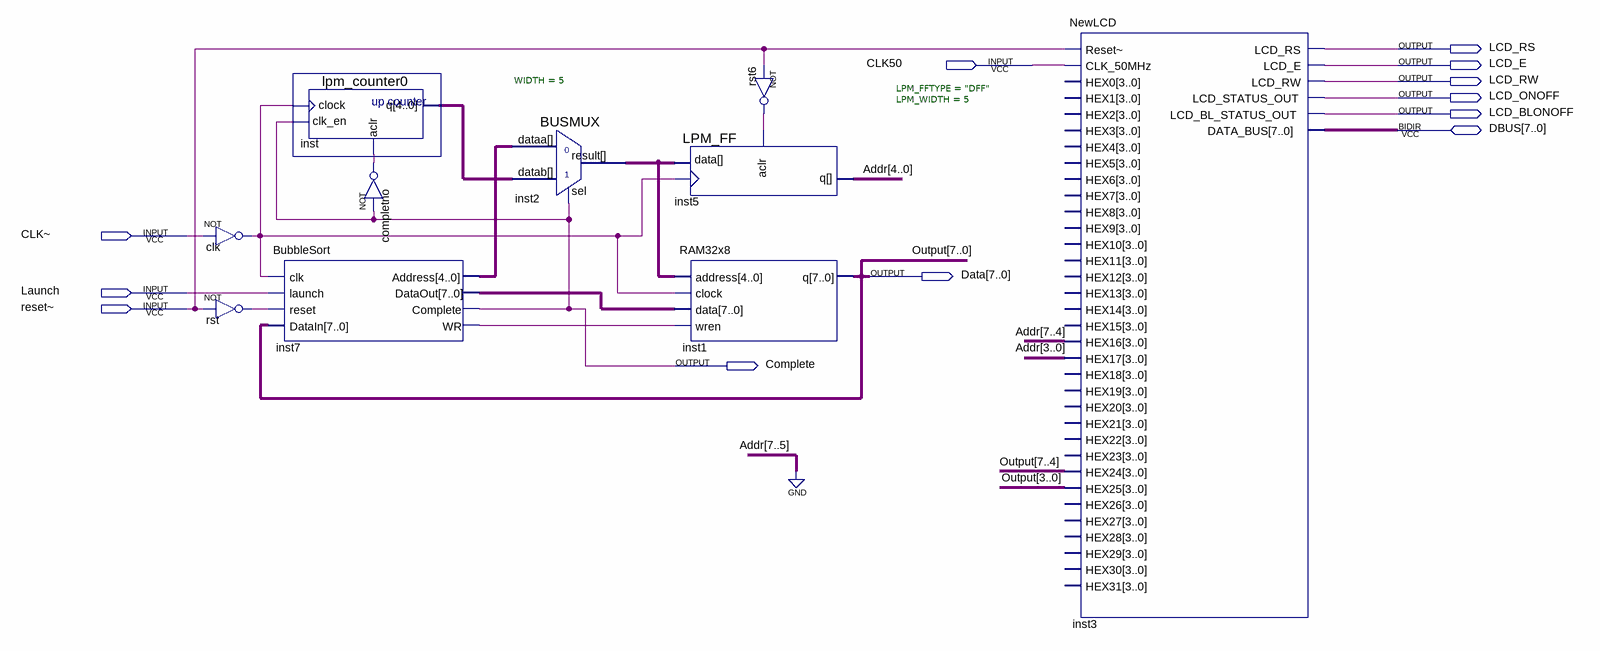
[diagram p0: schematic sheet]
// Quartus schematic Sorterbdf.bdf as structural Verilog: 10 symbols, 12 pins
module Sorterbdf (
  input  CLK50,
  input  \CLK~ ,
  input  Launch,
  input  \reset~ ,
  inout  [7:0] DBUS,
  output LCD_RS,
  output LCD_E,
  output LCD_RW,
  output LCD_ONOFF,
  output LCD_BLONOFF,
  output [7:0] Data,
  output Complete
);

  wire clk_out, completno_out, inst7_wr, rst6_out, rst_out;
  wire [4:0] Addr, inst2_result, inst7_address, inst_q;
  wire [7:0] inst7_dataout;

  not clk (clk_out, \CLK~ );
  not rst (rst_out, \reset~ );
  BubbleSort inst7 (
    .clk(clk_out), .launch(Launch), .reset(rst_out), .DataIn(Data), .Address(inst7_address),
    .DataOut(inst7_dataout), .Complete(Complete), .WR(inst7_wr));
  lpm_counter0 inst (.clock(clk_out), .clk_en(Complete), .aclr(completno_out), .q(inst_q));
  not completno (completno_out, Complete);
  BUSMUX #(.WIDTH(5)) inst2 (.datab(inst_q), .sel(Complete), .dataa(inst7_address), .result(inst2_result));
  LPM_FF #(.LPM_FFTYPE("DFF"), .LPM_WIDTH(5)) inst5 (.clock(clk_out), .aclr(rst6_out), .data(inst2_result), .q(Addr));
  RAM32x8 inst1 (.address(inst2_result), .clock(clk_out), .data(inst7_dataout), .wren(inst7_wr), .q(Data));
  not rst6 (rst6_out, \reset~ );
  NewLCD inst3 (
    .\Reset~ (\reset~ ), .CLK_50MHz(CLK50), .HEX16({3'b000, Addr[4]}), .HEX17(Addr[3:0]), .HEX24(Data[7:4]),
    .HEX25(Data[3:0]), .LCD_RS(LCD_RS), .LCD_E(LCD_E), .LCD_RW(LCD_RW), .LCD_STATUS_OUT(LCD_ONOFF),
    .LCD_BL_STATUS_OUT(LCD_BLONOFF), .DATA_BUS(DBUS));  // open: HEX0, HEX1, HEX2, HEX3, HEX4, HEX5, HEX6, HEX7, HEX8, HEX9, HEX10, HEX11, HEX12, HEX13, HEX14, HEX15, HEX18, HEX19, HEX20, HEX21, HEX22, HEX23, HEX26, HEX27, HEX28, HEX29, HEX30, HEX31

  // Other names for the same wires on the sheet: Output[7:0] = Data
endmodule
